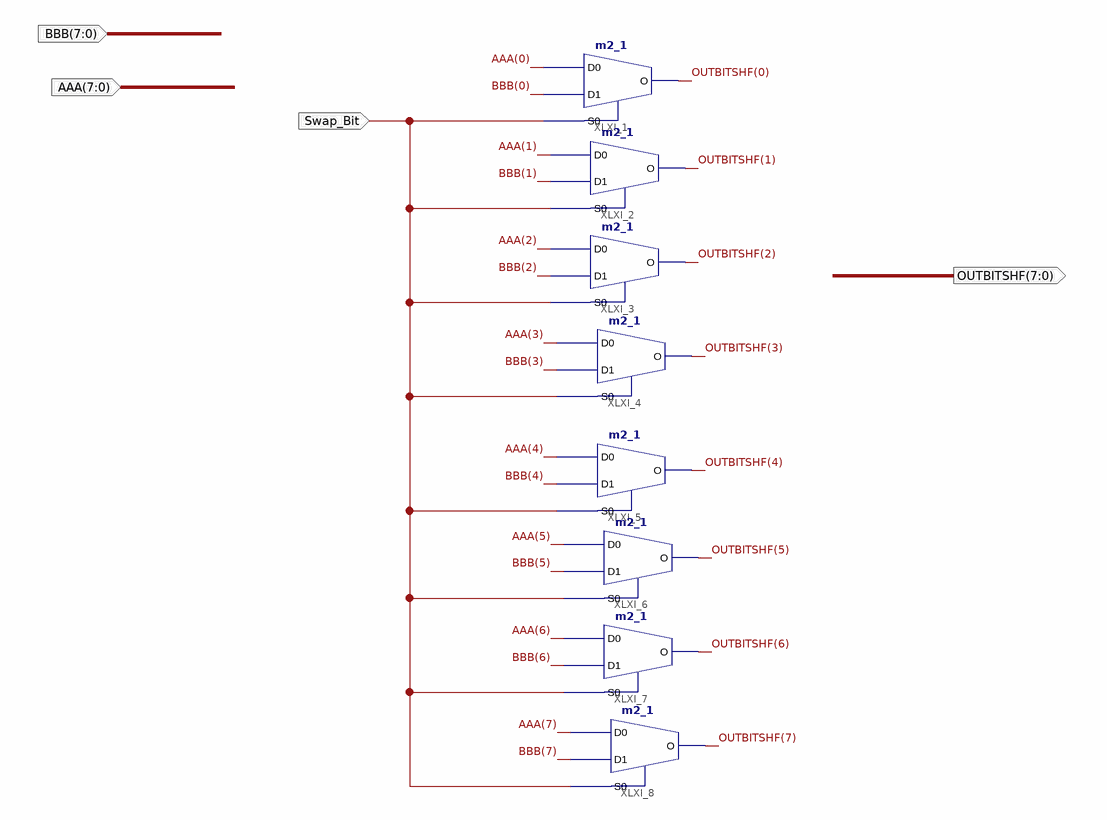
[diagram p0: schematic sheet 1]
// Xilinx ISE schematic SwapSHF_8_2_1.sch (spartan6) as structural Verilog: 8 symbols, 4 ports
module SwapSHF_8_2_1 (
  input  Swap_Bit,
  input  [7:0] BBB,
  input  [7:0] AAA,
  output [7:0] OUTBITSHF
);

  m2_1 XLXI_1 (.D0(AAA[0]), .D1(BBB[0]), .S0(Swap_Bit), .O(OUTBITSHF[0]));
  m2_1 XLXI_2 (.D0(AAA[1]), .D1(BBB[1]), .S0(Swap_Bit), .O(OUTBITSHF[1]));
  m2_1 XLXI_3 (.D0(AAA[2]), .D1(BBB[2]), .S0(Swap_Bit), .O(OUTBITSHF[2]));
  m2_1 XLXI_4 (.D0(AAA[3]), .D1(BBB[3]), .S0(Swap_Bit), .O(OUTBITSHF[3]));
  m2_1 XLXI_5 (.D0(AAA[4]), .D1(BBB[4]), .S0(Swap_Bit), .O(OUTBITSHF[4]));
  m2_1 XLXI_6 (.D0(AAA[5]), .D1(BBB[5]), .S0(Swap_Bit), .O(OUTBITSHF[5]));
  m2_1 XLXI_7 (.D0(AAA[6]), .D1(BBB[6]), .S0(Swap_Bit), .O(OUTBITSHF[6]));
  m2_1 XLXI_8 (.D0(AAA[7]), .D1(BBB[7]), .S0(Swap_Bit), .O(OUTBITSHF[7]));
endmodule
